# Altium schematic sheet BPC_Clock.SchDoc
size A4
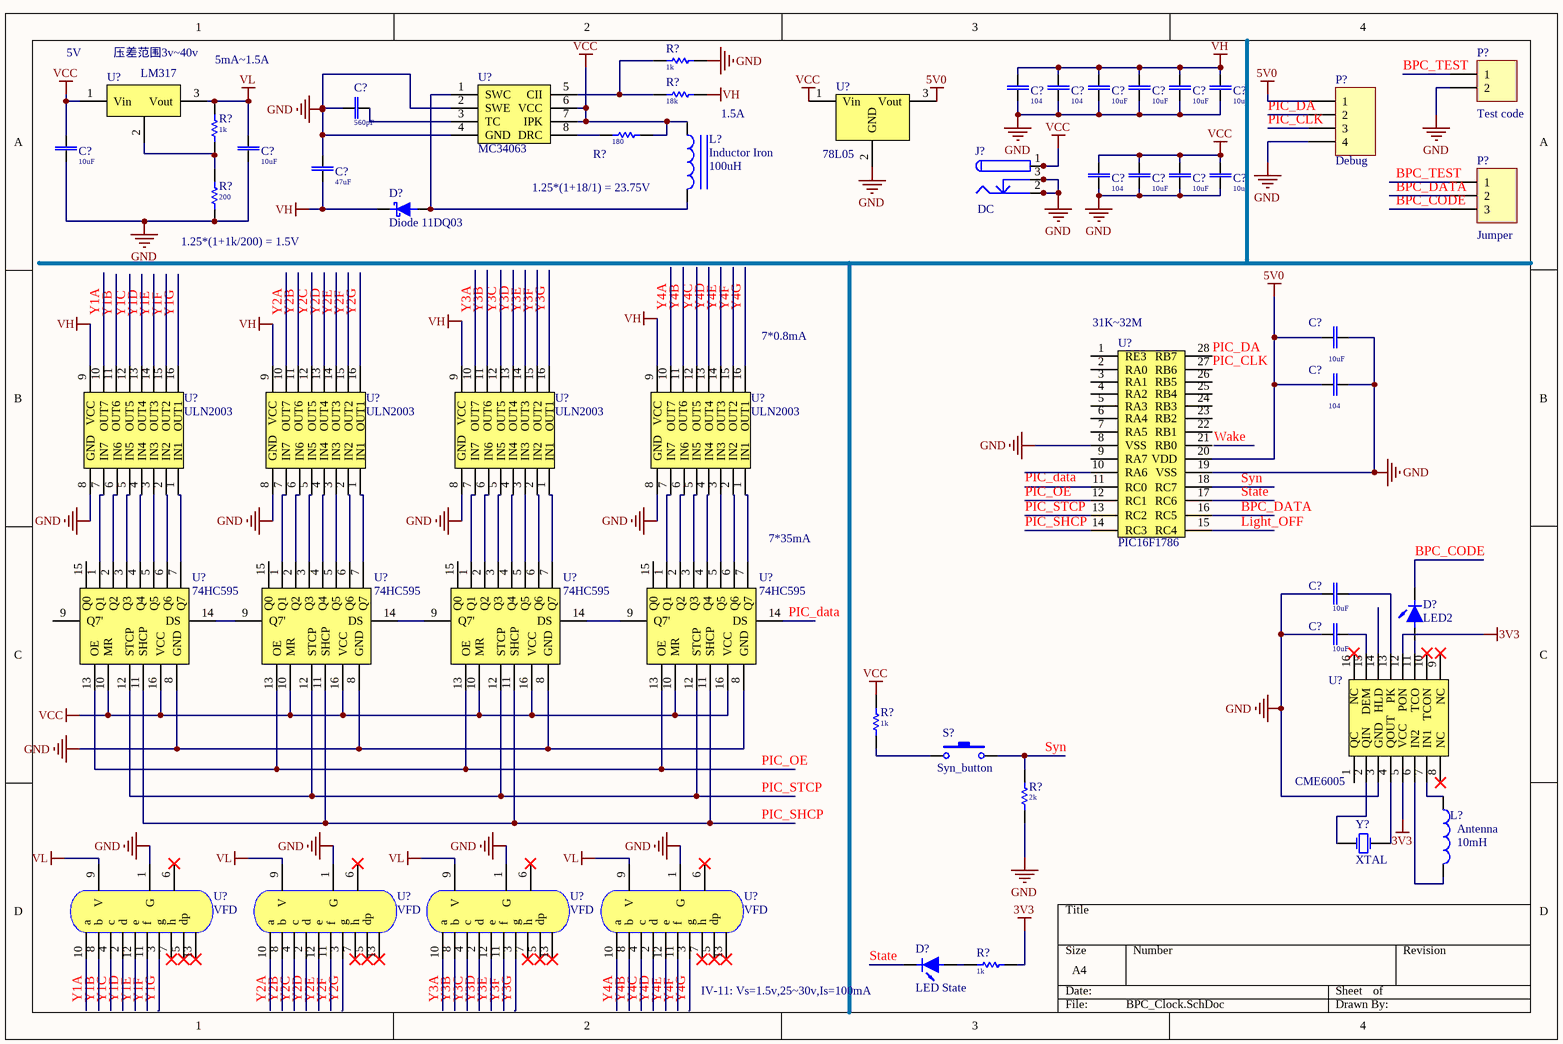
[diagram p0: BPC_Clock.SchDoc]

## Parts
(Parts that share a designator on the sheet are numbered #1, #2 ... from top to bottom, then left to right.)
C?#1  value 104  (hidden comment: Cap)
C?#2  value 104  (hidden comment: Cap)
C?#3  value 10uF  (hidden comment: Cap)
C?#4  value 10uF  (hidden comment: Cap)
C?#5  value 10uF  (hidden comment: Cap)
C?#6  value 10uF  (hidden comment: Cap)
C?#7  value 560pF  (hidden comment: Cap)
C?#8  value 10uF  (hidden comment: Cap)
C?#9  value 10uF  (hidden comment: Cap)
C?#10  value 47uF  (hidden comment: Cap)
C?#11  value 104  (hidden comment: Cap)
C?#12  value 10uF  (hidden comment: Cap)
C?#13  value 10uF  (hidden comment: Cap)
C?#14  value 10uF  (hidden comment: Cap)
C?#15  value 10uF  (hidden comment: Cap)
C?#16  value 104  (hidden comment: Cap)
C?#17  value 10uF  (hidden comment: Cap)
C?#18  value 10uF  (hidden comment: Cap)
D?#1  Diode 11DQ03  [DIO10.46-5.3x2.8]
D?#2  LED2  [DSO-F2/D6.1]
D?#3  LED State  [DSO-F2/D6.1]
J?  DC  [KLD-0202]
L?#1  Inductor Iron  value 100uH  [AXIAL-0.9]
L?#2  Antenna  value 10mH  [INDC1005AL]
P?#1  Test code  [HDR1X2]
P?#2  Debug  [HDR1X4]
P?#3  Jumper  [HDR1X3]
R?#1  1k  [RES 0805N (2012)]
R?#2  18k  [RES 0805N (2012)]
R?#3  1k  [RES 0805N (2012)]
R?#4  180  [RES 0805N (2012)]
R?#5  200  [RES 0805N (2012)]
R?#6  1k  [RES 0805N (2012)]
R?#7  2k  [RES 0805N (2012)]
R?#8  1k  [RES 0805N (2012)]
S?  Syn_button  [SPST-2]
U?#1  LM317
U?#2  78L05
U?#3  MC34063
U?#4  PIC16F1786
U?#5  ULN2003
U?#6  ULN2003
U?#7  ULN2003
U?#8  ULN2003
U?#9  74HC595
U?#10  74HC595
U?#11  74HC595
U?#12  74HC595
U?#13  CME6005
U?#14  VFD
U?#15  VFD
U?#16  VFD
U?#17  VFD
Y?  XTAL  [BCY-W2/D3.1]

## Nets
3V3: R?#8.2 U?#13.5(VCC) U?#13.12(PON)
5V0: C?#15.1 C?#16.1 P?#2.1 U?#2.3(Vout) U?#4.20(VDD)
GND: C?#1.2 C?#2.2 C?#3.2 C?#4.2 C?#5.2 C?#6.2 C?#7.2 C?#8.2 C?#9.2 C?#10.1 C?#11.2 C?#12.2 C?#13.2 C?#14.2 C?#15.2 C?#16.2 C?#17.2 C?#18.2 J?.2 J?.2A J?.2B J?.3 J?.3A J?.3B P?#1.2 P?#2.4 R?#1.1 R?#5.1 R?#7.1 U?#2.2(GND) U?#3.2(SWE) U?#3.4(GND) U?#4.8(VSS) U?#4.19(VSS) U?#5.8(GND) U?#6.8(GND) U?#7.8(GND) U?#8.8(GND) U?#9.8(GND) U?#10.8(GND) U?#11.8(GND) U?#12.8(GND) U?#13.3(GND) U?#14.1(G) U?#15.1(G) U?#16.1(G) U?#17.1(G)
VCC: C?#8.1 C?#11.1 C?#12.1 C?#13.1 C?#14.1 J?.1 J?.1A J?.1B L?#1.1 R?#4.1 R?#6.2 U?#1.1(Vin) U?#2.1(Vin) U?#3.6(VCC) U?#3.7(IPK) U?#9.10(MR) U?#9.16(VCC) U?#10.10(MR) U?#10.16(VCC) U?#11.10(MR) U?#11.16(VCC) U?#12.10(MR) U?#12.16(VCC)
VH: C?#1.1 C?#2.1 C?#3.1 C?#4.1 C?#5.1 C?#6.1 C?#10.2 D?#1.2(K) R?#2.1 U?#5.9(VCC) U?#6.9(VCC) U?#7.9(VCC) U?#8.9(VCC)
VL: C?#9.1 R?#3.2 U?#1.3(Vout) U?#14.9(V) U?#15.9(V) U?#16.9(V) U?#17.9(V)
BPC_CODE: D?#2.2(K) P?#3.3
BPC_DATA: P?#3.2 U?#4.16(RC5)
BPC_TEST: P?#1.1 P?#3.1
Light_OFF: U?#4.15(RC4)
PIC_CLK: P?#2.3 U?#4.27(RB6)
PIC_DA: P?#2.2 U?#4.28(RB7)
PIC_data: U?#12.14(DS)
PIC_OE: U?#4.12(RC1) U?#9.13(OE) U?#10.13(OE) U?#11.13(OE) U?#12.13(OE)
PIC_SHCP: U?#4.14(RC3) U?#9.11(SHCP) U?#10.11(SHCP) U?#11.11(SHCP) U?#12.11(SHCP)
PIC_STCP: U?#4.13(RC2) U?#9.12(STCP) U?#10.12(STCP) U?#11.12(STCP) U?#12.12(STCP)
State: D?#3.2(K) U?#4.17(RC6)
Syn: R?#7.2 S?.2 U?#4.18(RC7)
Y1A: U?#5.10(OUT7) U?#14.10(a)
Y1B: U?#5.11(OUT6) U?#14.8(b)
Y1C: U?#5.12(OUT5) U?#14.4(c)
Y1D: U?#5.13(OUT4) U?#14.2(d)
Y1E: U?#5.14(OUT3) U?#14.12(e)
Y1F: U?#5.15(OUT2) U?#14.11(f)
Y1G: U?#5.16(OUT1) U?#14.3(g)
Y2A: U?#6.10(OUT7) U?#15.10(a)
Y2B: U?#6.11(OUT6) U?#15.8(b)
Y2C: U?#6.12(OUT5) U?#15.4(c)
Y2D: U?#6.13(OUT4) U?#15.2(d)
Y2E: U?#6.14(OUT3) U?#15.12(e)
Y2F: U?#6.15(OUT2) U?#15.11(f)
Y2G: U?#6.16(OUT1) U?#15.3(g)
Y3A: U?#7.10(OUT7) U?#16.10(a)
Y3B: U?#7.11(OUT6) U?#16.8(b)
Y3C: U?#7.12(OUT5) U?#16.4(c)
Y3D: U?#7.13(OUT4) U?#16.2(d)
Y3E: U?#7.14(OUT3) U?#16.12(e)
Y3F: U?#7.15(OUT2) U?#16.11(f)
Y3G: U?#7.16(OUT1) U?#16.3(g)
Y4A: U?#8.10(OUT7) U?#17.10(a)
Y4B: U?#8.11(OUT6) U?#17.8(b)
Y4C: U?#8.12(OUT5) U?#17.4(c)
Y4D: U?#8.13(OUT4) U?#17.2(d)
Y4E: U?#8.14(OUT3) U?#17.12(e)
Y4F: U?#8.15(OUT2) U?#17.11(f)
Y4G: U?#8.16(OUT1) U?#17.3(g)
NetC?#7_1: C?#7.1 U?#3.3(TC)
NetC?#17_1: C?#17.1 U?#13.13(PK)
NetC?#18_1: C?#18.1 U?#13.15(DEM)
NetD?#1_1: D?#1.1(A) L?#1.2 U?#3.1(SWC)
NetD?#2_1: D?#2.1(A) U?#13.11(TCO)
NetD?#3_1: D?#3.1(A) R?#8.1
NetL?#2_1: L?#2.1 U?#13.7(IN1)
NetL?#2_2: L?#2.2 U?#13.6(IN2)
NetR?#1_2: R?#1.2 R?#2.2 U?#3.5(CII)
NetR?#3_1: R?#3.1 R?#5.2 U?#1.2(Vad)
NetR?#4_2: R?#4.2 U?#3.8(DRC)
NetR?#6_1: R?#6.1 S?.1
NetU?#5_1: U?#5.1(IN1) U?#9.7(Q7)
NetU?#5_2: U?#5.2(IN2) U?#9.6(Q6)
NetU?#5_3: U?#5.3(IN3) U?#9.5(Q5)
NetU?#5_4: U?#5.4(IN4) U?#9.4(Q4)
NetU?#5_5: U?#5.5(IN5) U?#9.3(Q3)
NetU?#5_6: U?#5.6(IN6) U?#9.2(Q2)
NetU?#5_7: U?#5.7(IN7) U?#9.1(Q1)
NetU?#6_1: U?#6.1(IN1) U?#10.7(Q7)
NetU?#6_2: U?#6.2(IN2) U?#10.6(Q6)
NetU?#6_3: U?#6.3(IN3) U?#10.5(Q5)
NetU?#6_4: U?#6.4(IN4) U?#10.4(Q4)
NetU?#6_5: U?#6.5(IN5) U?#10.3(Q3)
NetU?#6_6: U?#6.6(IN6) U?#10.2(Q2)
NetU?#6_7: U?#6.7(IN7) U?#10.1(Q1)
NetU?#7_1: U?#7.1(IN1) U?#11.7(Q7)
NetU?#7_2: U?#7.2(IN2) U?#11.6(Q6)
NetU?#7_3: U?#7.3(IN3) U?#11.5(Q5)
NetU?#7_4: U?#7.4(IN4) U?#11.4(Q4)
NetU?#7_5: U?#7.5(IN5) U?#11.3(Q3)
NetU?#7_6: U?#7.6(IN6) U?#11.2(Q2)
NetU?#7_7: U?#7.7(IN7) U?#11.1(Q1)
NetU?#8_1: U?#8.1(IN1) U?#12.7(Q7)
NetU?#8_2: U?#8.2(IN2) U?#12.6(Q6)
NetU?#8_3: U?#8.3(IN3) U?#12.5(Q5)
NetU?#8_4: U?#8.4(IN4) U?#12.4(Q4)
NetU?#8_5: U?#8.5(IN5) U?#12.3(Q3)
NetU?#8_6: U?#8.6(IN6) U?#12.2(Q2)
NetU?#8_7: U?#8.7(IN7) U?#12.1(Q1)
NetU?#9_14: U?#9.14(DS) U?#10.9(Q7')
NetU?#10_14: U?#10.14(DS) U?#11.9(Q7')
NetU?#11_14: U?#11.14(DS) U?#12.9(Q7')
NetU?#13_2: U?#13.2(QIN) Y?.1(OSC1)
NetU?#13_4: U?#13.4(QOUT) Y?.2(OSC2)

Not connected (* = marked no-connect by the designer): U?#4 1(RE3) 2(RA0) 3(RA1) 4(RA2) 5(RA3) 6(RA4) 7(RA5) 9(RA7) 10(RA6) 11(RC0) 21(RB0) 22(RB1) 23(RB2) 24(RB3) 25(RB4) 26(RB5); U?#9 9(Q7') 15(Q0); U?#10 15(Q0); U?#11 15(Q0); U?#12 15(Q0); U?#13 1(QC) 8(NC)* 9(NC)* 10(TCON)* 14(HLD) 16(NC)*; U?#14 5(dp)* 6* 7(h)* 13(dp)*; U?#15 5(dp)* 6* 7(h)* 13(dp)*; U?#16 5(dp)* 6* 7(h)* 13(dp)*; U?#17 5(dp)* 6* 7(h)* 13(dp)*

## Notes on the sheet
- (near U?#1) 5V
- (near U?#1) 压差范围3v~40v
- 5mA~1.5A
- 1.5A
- (near R?#5) 1.25*(1+1k/200) = 1.5V
- (near L?#1) 1.25*(1+18/1) = 23.75V
- (near U?#8) 7*0.8mA
- (near U?#4) 31K~32M
- (near U?#12) 7*35mA
- IV-11: Vs=1.5v,25~30v,Is=100mA
- Labels drawn without touching a wire or pin: PIC_data

## Library data of the parts
C?#1-C?#18 = Cap: Capacitor; Published: 8-Jun-2000; LatestRevisionDate: 17-Jul-2002; LatestRevisionNote: Re-released for DXP Platform.; PackageReference: RAD-0.3; Publisher: Altium Limited
D?#1 = Diode 11DQ03: Schottky Rectifier; Published: 8-Jun-2000; LatestRevisionDate: 17-Jul-2002; LatestRevisionNote: Re-released for DXP Platform.; DatasheetVersion: Dec-1997; PackageReference: DO-204AL; Publisher: Altium Limited; Code_JEDEC: DO-204-AL; ComponentLink1Description: Manufacturer Link; ComponentLink1URL: http://www.irf.com/; ComponentLink2Description: Datasheet; ComponentLink2URL: http://www.irf.com/product-info/datasheets/data/11dq03.pdf
D?#2 D?#3 = LED2: Typical RED, GREEN, YELLOW, AMBER GaAs LED; Published: 8-Jun-2000; LatestRevisionDate: 17-Jul-2002; LatestRevisionNote: Re-released for DXP Platform.; PackageVersion: Feb-2002; PackageReference: 3.2X1.6X1.1; Publisher: Altium Limited
J? = PWR2.5: Low Voltage Power Supply Connector; Published: 17-Dec-2003; DatasheetDocument: 09-May-2002; Publisher: Altium Limited; ComponentLink1Description: Manufacturer Link; ComponentLink1URL: http://domino.kycon.com/internet/Products.html
L?#1 = Inductor Iron: Magnetic-Core Inductor; Published: 24-Mar-1999; LatestRevisionDate: 17-Jul-2002; LatestRevisionNote: Re-released for DXP Platform.; PackageReference: AXIAL-0.9; Publisher: Altium Limited
L?#2 = Inductor: Code_IEC: 1005; Published: 8-Jun-2000; LatestRevisionDate: 29-May-2009; LatestRevisionNote: IPC-7351 Footprint Added.; PackageReference: 0402-A; Publisher: Altium Limited; PackageDescription: Chip Inductor; Code_JEITA: 0402
P?#1 = Header 2: Header, 2-Pin; LatestRevisionDate: 17-Jul-2002; LatestRevisionNote: Re-released for DXP Platform.; Publisher: Altium Limited
P?#2 = Header 4: Header, 4-Pin; LatestRevisionDate: 17-Jul-2002; LatestRevisionNote: Re-released for DXP Platform.; Publisher: Altium Limited
P?#3 = Header 3: Header, 3-Pin; LatestRevisionDate: 17-Jul-2002; LatestRevisionNote: Re-released for DXP Platform.; Publisher: Altium Limited
R?#1-R?#8 = Res1: Resistor; Published: 8-Jun-2000; LatestRevisionDate: 17-Jul-2002; LatestRevisionNote: Re-released for DXP Platform.; PackageReference: AXIAL-0.3; Publisher: Altium Limited
  R?#1 R?#3 R?#6 R?#8: Value: 1k
  R?#2: Value: 18k
  R?#4: Value: 180
  R?#5: Value: 200
  R?#7: Value: 2k
S? = SW-PB: Switch; Published: 24-Mar-1999; LatestRevisionDate: 17-Jul-2002; LatestRevisionNote: Re-released for DXP Platform.; PackageReference: SPST-2; Publisher: Altium Limited
Y? = XTAL: Crystal Oscillator; Published: 8-Jun-2000; LatestRevisionDate: 17-Jul-2002; LatestRevisionNote: Re-released for DXP Platform.; PackageReference: R38; Publisher: Altium Limited